# EasyEDA Pro project 交流电压检测.eprj

# Schematic Schematic2_2
Board Name: 双向可选电压检测; Create Date: 2026-01-25; Page Name: P1; Project Name: 交流电压检测; Schematic Name: Schematic2_2; Update Date: 2026-03-18; Company: Werner; Page Size: A4; Version: V1.0
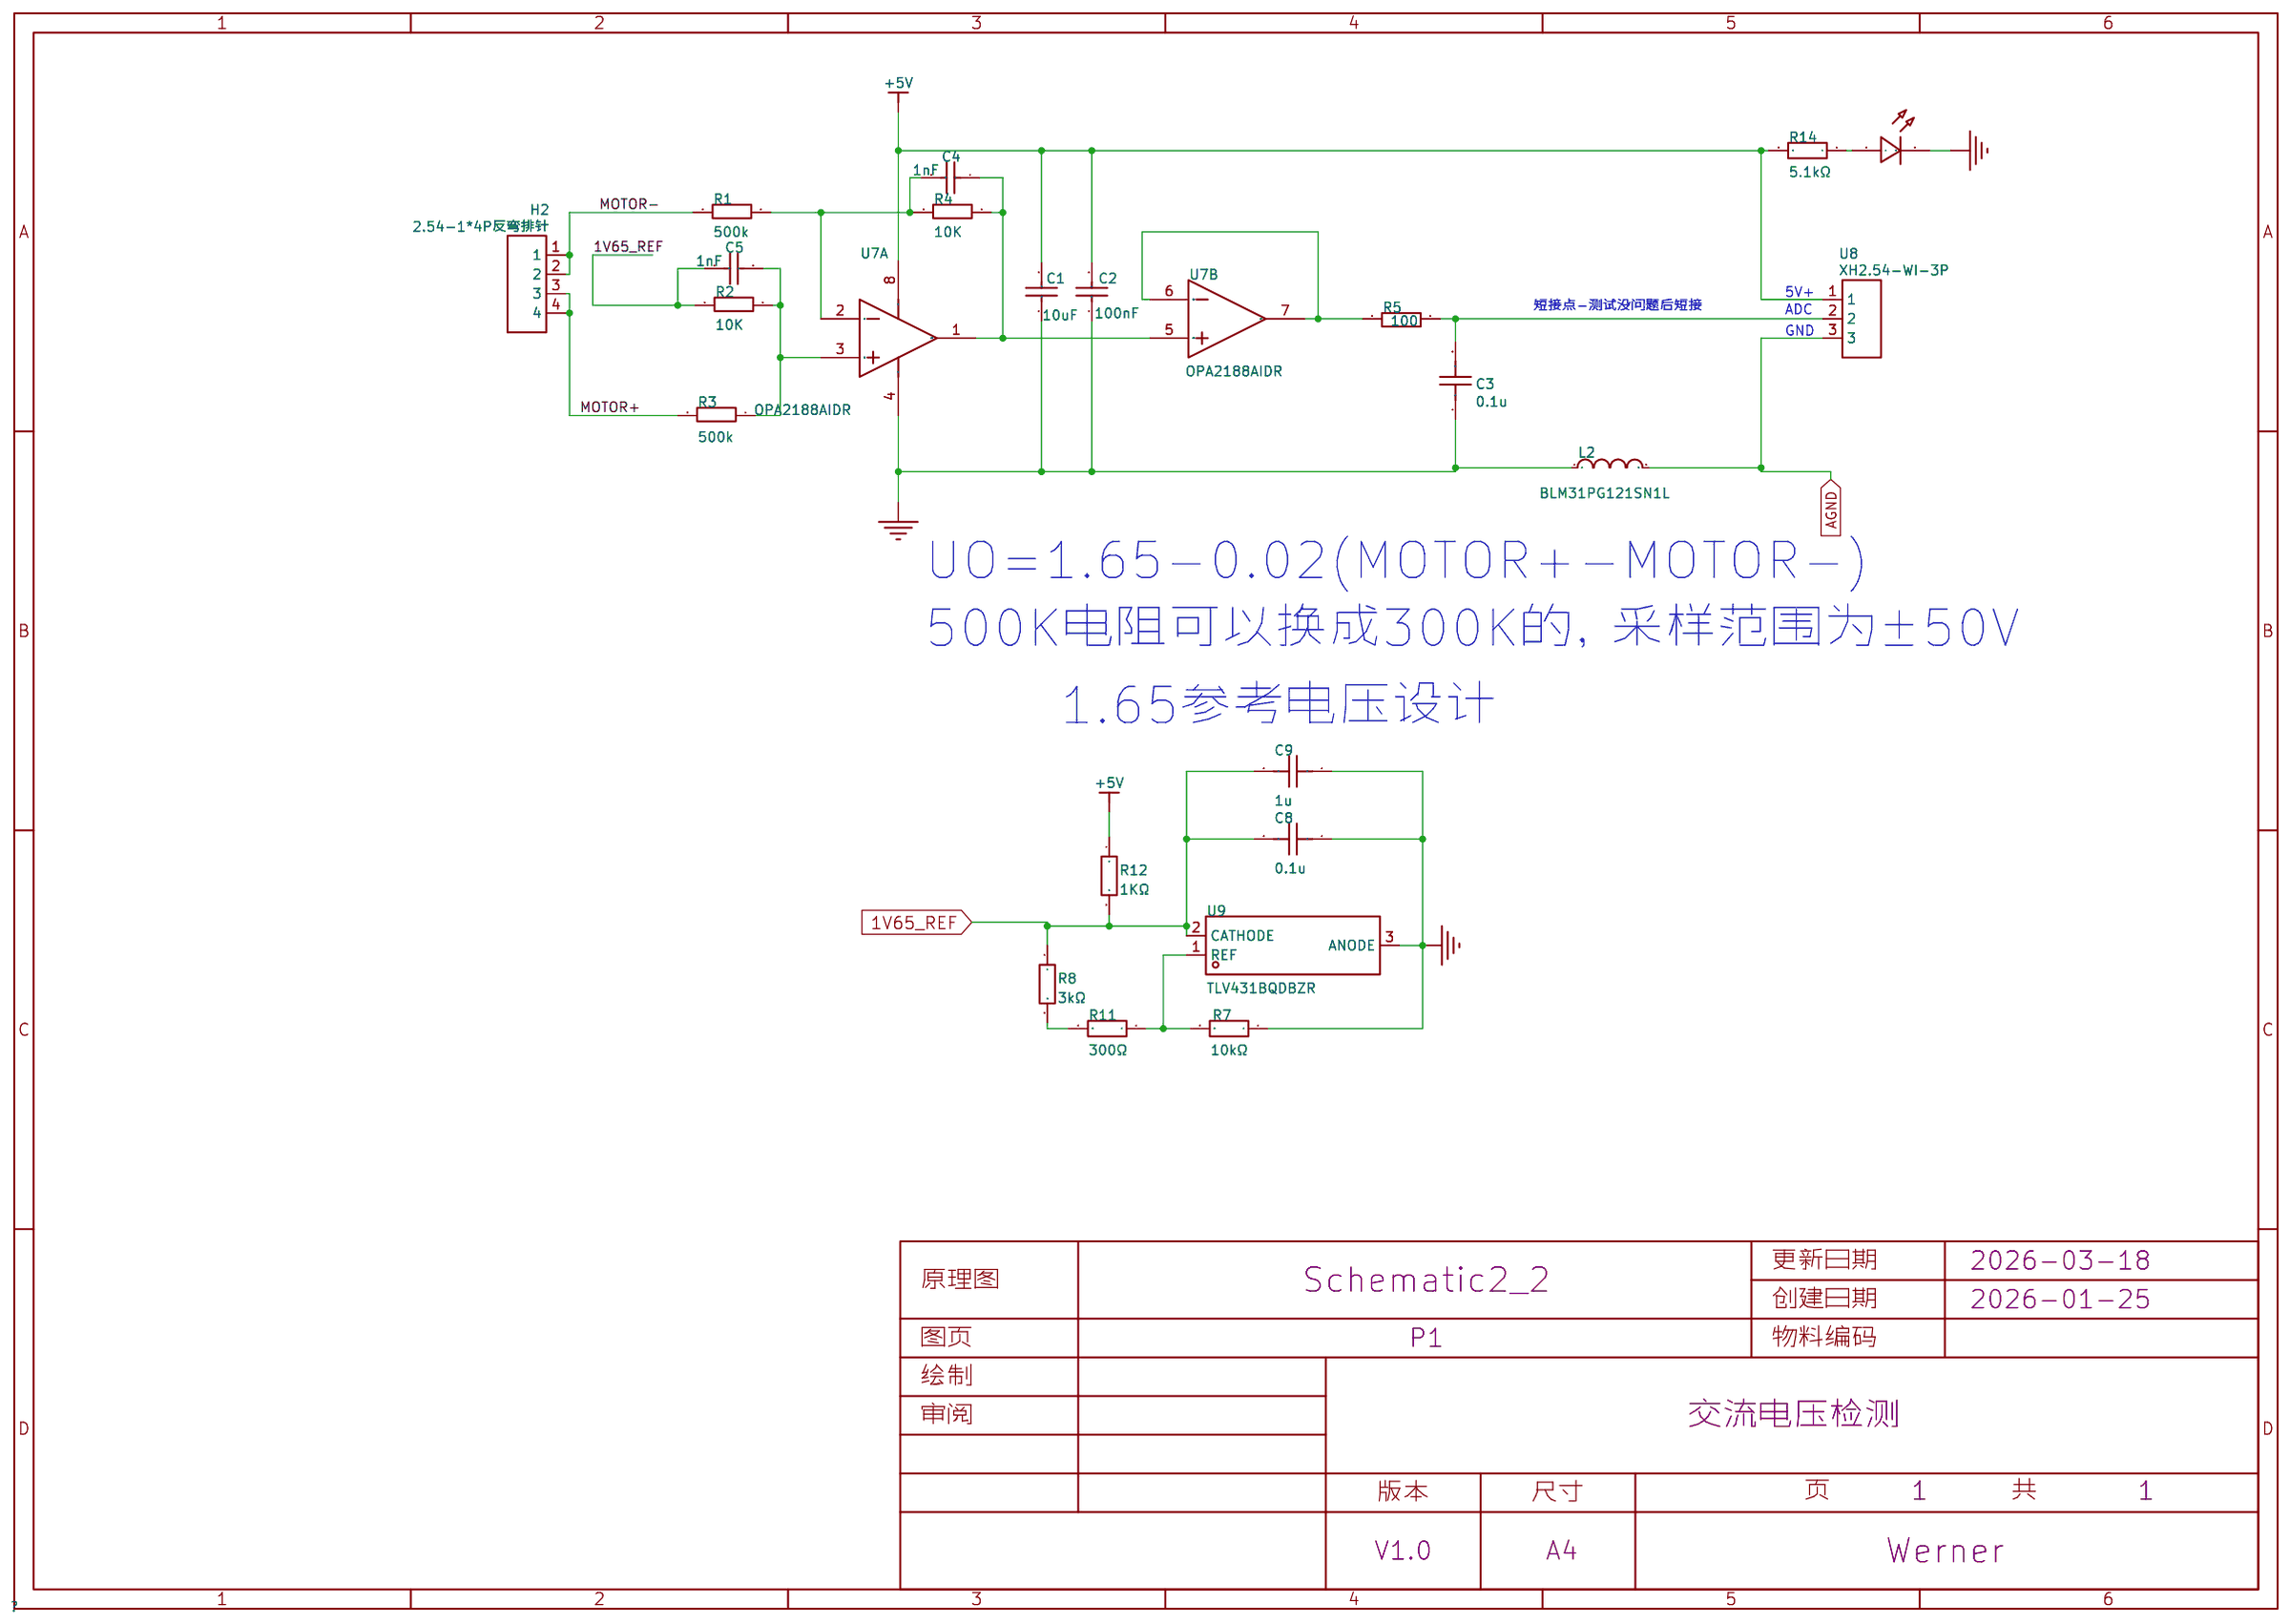
[diagram p0: schematic sheet]

## Parts
1.65V2  -  [LED_0603]
C1  10uF  [C0603]
C2  100nF  [C0603]
C3  0.1u  [C0603]
C4  1nF  [C0603]
C5  1nF  [C0603]
C8  0.1u  [C0603]
C9  1u  [C0603]
H2  2.54-1*4P反弯排针  [HDR-TH_4P-P2.54-H-M-W10.4]
L2  BLM31PG121SN1L  [L1206]
R1  500k  [R0603]
R2  10K  [R0603]
R3  500k  [R0603]
R4  10K  [R0603]
R5  100  [R0603]
R7  10kΩ  [R0603]
R8  3kΩ  [R0603]
R11  300Ω  [R0603]
R12  1KΩ  [R0603]
R14  5.1kΩ  [电阻（0603）]
U7  OPA2188AIDR  [SOIC-8_L4.9-W3.9-P1.27-LS6.0-BL_1]  (sections 1,2)
U8  XH2.54-WI-3P  [CONN-TH_XH2.54-WI-3P]
U9  TLV431BQDBZR  [SOT-23-3_L2.9-W1.3-P0.95-LS2.4-BR]

## Library data of the parts
1.65V2 = LED_0603-R: Supplier Footprint: 0603
C1 C2 = 0805B104K500NT: LCSC Part Name: 100nF ±10% 50V; Supplier Part: C38141; Manufacturer: FH(风华); Supplier Footprint: 0805; JLCPCB Part Class: Extended Part; Datasheet: https://atta.szlcsc.com/upload/public/pdf/source/20200305/C486355_26A10D38EF8C2A5C37091D0039909270.pdf; Supplier: LCSC; Tolerance: ±10%; Voltage Rated: 50V; Temperature Coefficient: X7R
C3 C8 C9 = 0.1u
C4 C5 = 0805B104K500NT: 容值:100nF;精度:±10%;额定电压:50V;材质(温度系数):X7R;; LCSC Part Name: 100nF ±10% 50V; Supplier Part: C38141; Manufacturer: FH(风华); Supplier Footprint: 0805; JLCPCB Part Class: Extended Part; Datasheet: https://atta.szlcsc.com/upload/public/pdf/source/20200305/C486355_26A10D38EF8C2A5C37091D0039909270.pdf; Supplier: LCSC; Tolerance: ±10%; Voltage Rated: 50V; Temperature Coefficient: X7R
H2 = 2.54-1*4P反弯排针: Supplier: LCSC; Supplier Part: C91552; Manufacturer: BOOMELE(博穆精密); JLCPCB Part Class: Extended Part
L2 = BLM31PG121SN1L: LCSC Part Name: 单路 1206磁珠 阻抗120Ω@100MHz; Supplier Part: C85841; Manufacturer: muRata(村田); Supplier Footprint: 1206; JLCPCB Part Class: 扩展库; Datasheet: https://item.szlcsc.com/datasheet/BLM31PG121SN1L/87017.html; Supplier: LCSC; Impedance @ Frequency: 120Ω@100MHz; Tolerance: ±25%; DC Resistance(DCR): 20mΩ; Current Rating: 3.5A; Number of Circuits: 1; Operating Temperature: -55℃~+125℃
R1 R3 = 10K
R2 = 1K
R4 R5 = 4.7K
R7 R8 R11 R12 R14 = 0805W8F5101T5E: LCSC Part Name: 5.1kΩ ±1% 125mW 厚膜电阻; Supplier Part: C27834; Manufacturer: UNI-ROYAL(厚声); Supplier Footprint: 0805; JLCPCB Part Class: Basic Part; Datasheet: https://atta.szlcsc.com/upload/public/pdf/source/20200306/C422600_1E6D84923E4A46A82E41ADD87F860B5C.pdf; Supplier: LCSC; Type: 厚膜电阻; Tolerance: ±1%; Power(Watts): 125mW; Overload Voltage (Max): 150V; Temperature Coefficient: ±100ppm/℃; Operating Temperature Range: -55℃~+155℃
U7 = OPA2188AIDR: LCSC Part Name: OPA2188AIDR  零漂移; Supplier Part: C17271; Manufacturer: TI(德州仪器); Supplier Footprint: SOIC-8; JLCPCB Part Class: 扩展库; Datasheet: https://www.ti.com/cn/lit/gpn/opa2188; Supplier: LCSC; Number of Channels: 双路; Gain Bandwidth Product: 2MHz; Ib - Input Bias Current: 160pA; Vos - Input Offset Voltage: 6uV; Common Mode Rejection Ratio(CMRR): 146dB; Slew Rate: 0.8V/us; Output Current: 18mA; Rail to Rail: 轨到轨输出; Quiescent Current(Iq): 475uA; Operating Temperature: -40℃~+105℃; Single Supply: 4V~36V; Dual Supply: -18V~-2V；2V~18V; Maximum Power Supply Range (Vdd-Vss): 36V; Noise density(eN): 8.8nV/√Hz@1kHz; Input Offset Current(Ios): 320pA
U8 = XH2.54-WI-3P: Supplier: LCSC; Supplier Part: C9900005531; Manufacturer: null; JLCPCB Part Class: Extended Part
U9 = TLV431BQDBZR: LCSC Part Name: TLV431x 低电压可调精密分流稳压器; Supplier Part: C398374; Manufacturer: TI(德州仪器); Supplier Footprint: SOT-23-3; JLCPCB Part Class: 扩展库; Datasheet: https://www.ti.com/cn/lit/gpn/tlv431b; Supplier: LCSC; Output Type: 可调; Output Voltage: 1.24V~6V; Output Current: 15mA; Tolerance: ±0.5%; Reference Type: 并联; Minimum Cathode Current for Regulation: 80uA; Operating Temperature: -40℃~+125℃

## Nets
1V65_REF: C5.2 C8.2 C9.2 R2.2 R8.1 R12.2 U9.2(CATHODE)
+5V: C1.2 C2.2 R12.1 R14.2 U7.8(V+) U8.1
AGND: L2.2 U8.3
GND: 1.65V2.1(C) C1.1 C2.1 C3.1 C8.1 C9.1 L2.1 R7.1 U7.4(V-) U9.3(ANODE)
MOTOR+: H2.3 H2.4 R3.2
MOTOR-: H2.1 H2.2 R1.2
$4N903: C5.1 R2.1 R3.1 U7.3(IN A+)
$4N906: C4.2 R1.1 R4.2 U7.2(IN A-)
$4N908: C4.1 R4.1 U7.1(OUT A) U7.5(IN B+)
$4N913: R5.1 U7.6(IN B-) U7.7(OUT B)
$4N919: R8.2 R11.2
$4N920: R7.2 R11.1 U9.1(REF)
$4N1526: C3.2 R5.2 U8.2
$4N2200: 1.65V2.2(A) R14.1

## Notes on the sheet
- 短接点-️测试没问题后短接
- 5V+
- ADC
- GND
- UO=1.65-0.02(MOTOR+-MOTOR-)
- 500K电阻可以换成300K的，采样范围为±50V
- 1.65参考电压设计

# Board PCB2_3
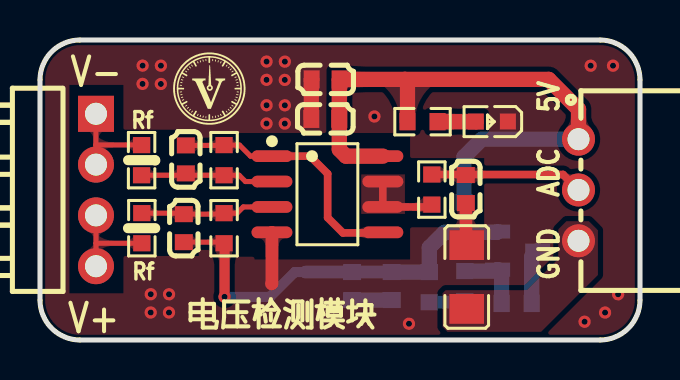
[diagram p1: board, top side]
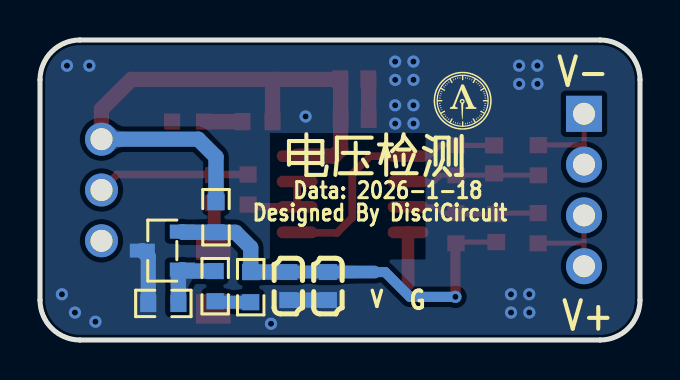
[diagram p2: board, bottom side, seen from below]

Outline 30 x 15 mm; copper layers: Top Layer, Bottom Layer. Coordinates in mm from the lower left corner of the outline.
Outline path: 0,13 0,2 arc(0.59,0.59) 2,0 28,0 arc(29.41,0.59) 30,2 30,13 arc(29.41,14.41) 28,15 2,15 arc(0.59,14.41) 0,13
Stack: Top Layer 0.035mm / Dielectric1 1.51mm FR4 er 4.5 / Bottom Layer 0.035mm

## Design rules (mm)
net MOTOR-: DP2
net MOTOR+: DP2
spacing copperThickness1oz (default): track to track 0.102, other pairs 0.152 to 0.3
spacing copperThickness2oz: track to track 0.203, other pairs 0.152 to 0.3
spacing Plane_innerPlane: track to track 0.102, other pairs 0.152 to 0.3
spacing Copper_copperRegion: track to track 0.102, other pairs 0.152 to 0.3
track width copperThickness1oz (default): min 0.127, default 0.254, max 2.54
track width copperThickness2oz: min 0.203, default 0.254, max 2.54
differential pair differentialPair (default): width min 0.127, default 0.254, max 2.54; gap min 0.152, default 0.152
via viaSize (default): diameter min 0.5, default 0.61, max 10; hole min 0.3, default 0.305, max 6.3
pour e83 uses Copper_copperRegion
pour e85 uses Copper_copperRegion

## Placement (name value [footprint] x y rotation side)
1.65V2  -  [LED_0603]  22.54 10.92 180 top
C1  10uF  [C0603]  14.27 11.06 0 top
C2  100nF  [C0603]  14.28 13.03 0 top
C3  0.1u  [C0603]  21.29 7.55 90 top
C4  1nF  [C0603]  7.29 9.03 270 top
C5  1nF  [C0603]  7.19 5.59 270 top
C8  0.1u  [C0603]  17.59 2.7 90 bottom
C9  1u  [C0603]  15.6 2.7 90 bottom
H2  2.54-1*4P反弯排针  [HDR-TH_4P-P2.54-H-M-W10.4]  2.8 7.5 270 top
L2  BLM31PG121SN1L  [L1206]  21.34 3.15 270 top
R1  500k  [R0603]  5.08 8.99 90 top
R2  10K  [R0603]  9.2 5.59 270 top
R3  500k  [R0603]  5.09 5.59 270 top
R4  10K  [R0603]  9.2 8.99 270 top
R5  100  [R0603]  19.59 7.52 90 top
R7  10kΩ  [R0603]  23.83 1.83 180 bottom
R8  3kΩ  [R0603]  19.46 2.64 270 bottom
R11  300Ω  [R0603]  21.24 2.69 270 bottom
R12  1KΩ  [R0603]  21.2 6.14 270 bottom
R14  5.1kΩ  [电阻（0603）]  19.12 10.92 180 top
U7  OPA2188AIDR  [SOIC-8_L4.9-W3.9-P1.27-LS6.0-BL_1]  14.37 7.29 270 top
U8  XH2.54-WI-3P  [CONN-TH_XH2.54-WI-3P]  26.93 7.5 270 top
U9  TLV431BQDBZR  [SOT-23-3_L2.9-W1.3-P0.95-LS2.4-BR]  23.88 4.47 180 bottom

## Footprints (pads in the part's own frame, mm; a bottom-side part is the same pattern mirrored in y, then rotated)
C0603
  rect 0.8x0.9 smd: 1(-0.7,0) 2(0.7,0)
CONN-TH_XH2.54-WI-3P
  round 1.65 hole 1.1: 1(-2.54,0) 2(0,0) 3(2.54,0)
HDR-TH_4P-P2.54-H-M-W10.4
  rect 1.8x1.8 hole 1.1: 1(-3.81,0)
  round 1.8 hole 1.1: 2(-1.27,0) 3(1.27,0) 4(3.81,0)
L1206
  rect 1.485x1.728 smd: 1(-1.593,0) 2(1.593,0)
LED_0603
  rect 0.8x0.8 smd: 1(-0.851,-0.01) 2(0.75,-0.005)
R0603
  rect 0.806x0.864 smd: 1(-0.753,0) 2(0.753,0)
SOIC-8_L4.9-W3.9-P1.27-LS6.0-BL_1
  oval 0.588x2.045 smd: 1(-1.905,-2.772) 2(-0.635,-2.772) 3(0.635,-2.772) 4(1.905,-2.772) 5(1.905,2.772) 6(0.635,2.772) 7(-0.635,2.772) 8(-1.905,2.772)
SOT-23-3_L2.9-W1.3-P0.95-LS2.4-BR
  rect 1.25x0.7 smd: 1(1,-0.95) 2(1,0.95) 3(-1,0)
电阻（0603）
  rect 0.806x0.864 smd: 1(-0.754,0) 2(0.752,0)

## Nets
As in the schematic.

## Via types
v1: diameter 0.61, hole 0.305, Top Layer to Bottom Layer, 24 vias

## Routing (per net, layer and track width the routed paths; a pad name or vN(x,y) marks a point on that pad's centre or on a via; arc(x,y) is an arc through that point)
1V65_REF: length 20.3
  Top Layer w0.254: C5.2 9.15,4.89
  Top Layer w0.508: v1(9.23,2.16) 9.23,4.81 R2.2
  Bottom Layer w0.508: v1(9.23,2.16) 11.5,2.16 12.74,3.4 13.22,3.4
  Bottom Layer w0.635: 13.27,3.4 17.59,3.4
  Bottom Layer w0.762: U9.2 22.85,5.39 R12.2 20.23,5.39 19.46,4.62 R8.1 19.46,3.4 17.59,3.4
+5V: length 30.4
  Top Layer w0.762: 26.93,10.04 26.93,11.54 25.43,13.03 18.24,13.03 ; R14.2 18.37,12.9 18.24,13.03 ; 18.24,13.03 14.98,13.03 14.97,13.01 C1.2 14.97,9.53 15.3,9.19 U7.8
  Bottom Layer w0.762: 26.93,10.04 22.09,10.04 21.2,9.15 R12.1
GND: length 11.4
  Top Layer w0.635: U7.4 11.6,2.83 11.58,2.81 ; L2.1 21.29,4.78 C3.1
  Top Layer w0.762: C2.1 13.57,13.01 C1.1
  Bottom Layer w0.762: U9.3 24.59,4.17 R7.1 ; C8.1 C9.1
  vias: v1(5.13,13.72) v1(5.13,12.8) v1(5.54,2.29) v1(5.53,1.37) v1(6.04,13.72) v1(6.04,12.8) v1(6.45,1.37) v1(6.45,2.29) v1(11.33,13.92) v1(11.33,13.01) v1(11.33,11.74) v1(11.33,10.82) v1(12.24,13.92) v1(12.24,13) v1(12.24,11.73) v1(12.24,10.82) v1(16.72,11.18) v1(18.45,0.81) v1(27.23,0.91) v1(27.53,13.72) v1(28.25,1.37) v1(28.65,13.72) v1(28.91,2.29)
MOTOR+: length 4.8
  Top Layer w0.254: 2.8,4.84 H2.3 ; 2.8,4.84 5.09,4.84 ; 2.8,4.84 H2.4
MOTOR-: length 4.8
  Top Layer w0.254: 2.79,9.75 2.79,8.78 H2.2 ; 2.79,9.75 2.79,11.3 H2.1 ; 2.79,9.75 5.07,9.75 R1.2
$4N903: length 6.6
  Top Layer w0.254: R3.1 5.09,6.34 7.16,6.34 ; U7.3 10.17,6.65 9.85,6.34 R2.1 9.15,6.29 C5.1
$4N906: length 6.6
  Top Layer w0.254: R1.1 R4.2 9.96,8.24 10.27,7.92 U7.2
$4N908: length 13
  Top Layer w0.254: C4.1 9.19,9.73 R4.1 9.97,9.75 10.53,9.19 U7.1
  Top Layer w0.381: U7.1 13.5,9.19 14.38,8.31 14.38,6.12 15.15,5.36 17.12,5.36 U7.5
$4N913: length 3.8
  Top Layer w0.381: U7.7 U7.6 19.48,6.65 R5.1
$4N919: length 1.8
  Bottom Layer w0.635: R11.2 21.19,1.89 R8.2
$4N920: length 3.4
  Bottom Layer w0.762: R7.2 23.08,3.32 U9.1 22.81,3.45 R11.1
$4N1526: length 7.7
  Top Layer w0.381: R5.2 26.15,8.27 26.93,7.5
$4N2200: length 1.9
  Top Layer w0.762: 1.65V2.2 21.79,10.92 R14.1

## Copper pours and planes (outline as drawn; the poured copper is in the pictures)
AGND on Top Layer: 20.13,5.94 27.9,5.94 27.9,0.41 20.13,0.41
GND on Top Layer: -11.43,21.8 41.5,21.8 41.5,-7.31 -11.43,-7.31
GND on Bottom Layer: -15.04,20.77 41.7,20.77 41.7,-3.61 -15.04,-3.61
$4N913 on Top Layer: 16.06,8.28 18.25,8.28 18.25,6.3 16.06,6.3

Small or netless copper shapes (teardrops, artwork), in the pictures only: 52 on Top Layer, 22 on Bottom Layer

## Text on the board
Bottom Silkscreen Layer: Data: 2026-1-18 | Designed By DisciCircuit | V | G | V+ | V- | 电压检测
Top Silkscreen Layer: Rf | 5V | ADC | GND | V+ | V- | 电压检测模块
